# Altium schematic sheet FPGA-4.SchDoc
size A3; Date: Date; CompanyName: HESSO; Engineer: Name; Address1: Route du Rawyl 47; Address2: 1950 Sion; Address3: Switzerland; ProjectName: Project Name
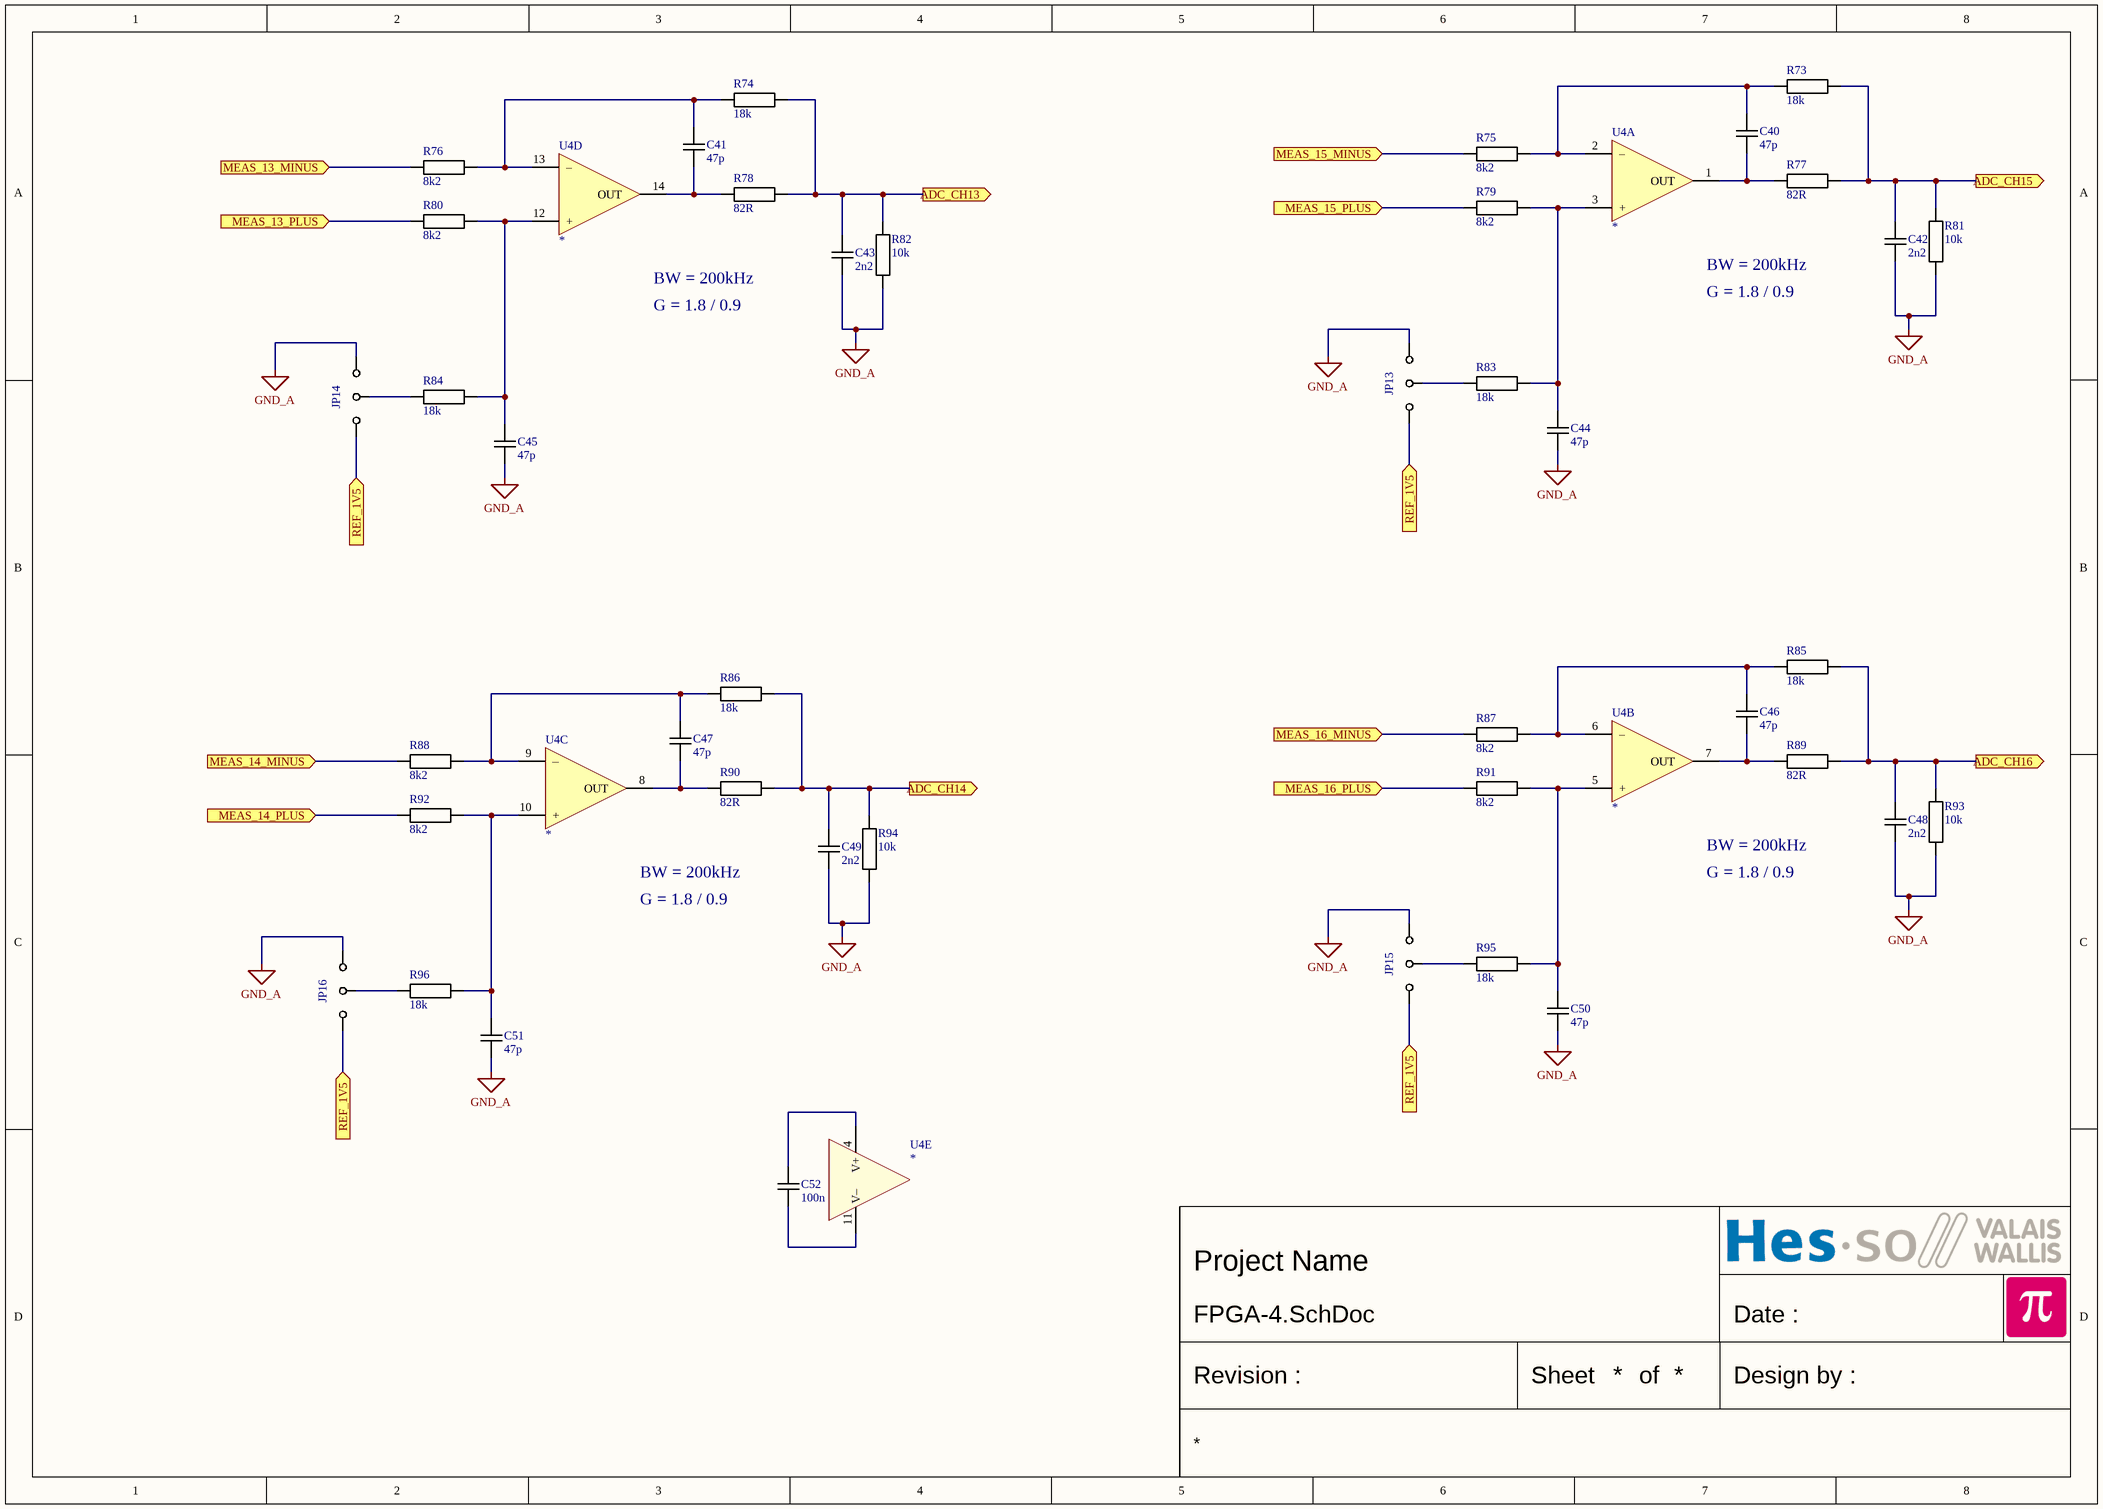
[diagram p0: FPGA-4.SchDoc]

## Parts
C40  47p  [CAPACITOR 1608 REFLOW]
C41  47p  [CAPACITOR 1608 REFLOW]
C42  2n2  [CAPACITOR 1608 REFLOW]
C43  2n2  [CAPACITOR 1608 REFLOW]
C44  47p  [CAPACITOR 1608 REFLOW]
C45  47p  [CAPACITOR 1608 REFLOW]
C46  47p  [CAPACITOR 1608 REFLOW]
C47  47p  [CAPACITOR 1608 REFLOW]
C48  2n2  [CAPACITOR 1608 REFLOW]
C49  2n2  [CAPACITOR 1608 REFLOW]
C50  47p  [CAPACITOR 1608 REFLOW]
C51  47p  [CAPACITOR 1608 REFLOW]
C52  100n  [CAPACITOR 1608 REFLOW]
JP13  {Value}  [JUMPER3 SMD 1608]  (value not drawn)
JP14  {Value}  [JUMPER3 SMD 1608]  (value not drawn)
JP15  {Value}  [JUMPER3 SMD 1608]  (value not drawn)
JP16  {Value}  [JUMPER3 SMD 1608]  (value not drawn)
R73  18k  [RESISTOR 1608 REFLOW]
R74  18k  [RESISTOR 1608 REFLOW]
R75  8k2  [RESISTOR 1608 REFLOW]
R76  8k2  [RESISTOR 1608 REFLOW]
R77  82R  [RESISTOR 1608 REFLOW]
R78  82R  [RESISTOR 1608 REFLOW]
R79  8k2  [RESISTOR 1608 REFLOW]
R80  8k2  [RESISTOR 1608 REFLOW]
R81  10k  [RESISTOR 1608 REFLOW]
R82  10k  [RESISTOR 1608 REFLOW]
R83  18k  [RESISTOR 1608 REFLOW]
R84  18k  [RESISTOR 1608 REFLOW]
R85  18k  [RESISTOR 1608 REFLOW]
R86  18k  [RESISTOR 1608 REFLOW]
R87  8k2  [RESISTOR 1608 REFLOW]
R88  8k2  [RESISTOR 1608 REFLOW]
R89  82R  [RESISTOR 1608 REFLOW]
R90  82R  [RESISTOR 1608 REFLOW]
R91  8k2  [RESISTOR 1608 REFLOW]
R92  8k2  [RESISTOR 1608 REFLOW]
R93  10k  [RESISTOR 1608 REFLOW]
R94  10k  [RESISTOR 1608 REFLOW]
R95  18k  [RESISTOR 1608 REFLOW]
R96  18k  [RESISTOR 1608 REFLOW]
U4  *  [SO14 P1.27 C4.0X8.8 H1.75]  (parts A,B,C,D,E of 5)

## Ports
ADC_CH13 (out), ADC_CH14 (out), ADC_CH15 (out), ADC_CH16 (out), MEAS_13_MINUS (in), MEAS_13_PLUS (in), MEAS_14_MINUS (in), MEAS_14_PLUS (in), MEAS_15_MINUS (in), MEAS_15_PLUS (in), MEAS_16_MINUS (in), MEAS_16_PLUS (in), REF_1V5 (in)

## Nets
GND_A: C42.1 C43.1 C44.1 C45.1 C48.1 C49.1 C50.1 C51.1 JP13.3 JP14.3 JP15.3 JP16.3 R81.2 R82.2 R93.2 R94.2
ADC_CH13: C43.2 R74.2 R78.2 R82.1 ; port ADC_CH13
ADC_CH14: C49.2 R86.2 R90.2 R94.1 ; port ADC_CH14
ADC_CH15: C42.2 R73.2 R77.2 R81.1 ; port ADC_CH15
ADC_CH16: C48.2 R85.2 R89.2 R93.1 ; port ADC_CH16
MEAS_13_MINUS: R76.1 ; port MEAS_13_MINUS
MEAS_13_PLUS: R80.1 ; port MEAS_13_PLUS
MEAS_14_MINUS: R88.1 ; port MEAS_14_MINUS
MEAS_14_PLUS: R92.1 ; port MEAS_14_PLUS
MEAS_15_MINUS: R75.1 ; port MEAS_15_MINUS
MEAS_15_PLUS: R79.1 ; port MEAS_15_PLUS
MEAS_16_MINUS: R87.1 ; port MEAS_16_MINUS
MEAS_16_PLUS: R91.1 ; port MEAS_16_PLUS
REF_1V5: JP13.1 JP14.1 JP15.1 JP16.1 ; port REF_1V5
NetC40_1: C40.1 R77.1 U4.1(OUT)
NetC40_2: C40.2 R73.1 R75.2 U4.2(–)
NetC41_1: C41.1 R78.1 U4.14(OUT)
NetC41_2: C41.2 R74.1 R76.2 U4.13(–)
NetC44_2: C44.2 R79.2 R83.1 U4.3(+)
NetC45_2: C45.2 R80.2 R84.1 U4.12(+)
NetC46_1: C46.1 R89.1 U4.7(OUT)
NetC46_2: C46.2 R85.1 R87.2 U4.6(–)
NetC47_1: C47.1 R90.1 U4.8(OUT)
NetC47_2: C47.2 R86.1 R88.2 U4.9(–)
NetC50_2: C50.2 R91.2 R95.1 U4.5(+)
NetC51_2: C51.2 R92.2 R96.1 U4.10(+)
NetC52_1: C52.1 U4.11(V–)
NetC52_2: C52.2 U4.4(V+)
NetJP13_2: JP13.2 R83.2
NetJP14_2: JP14.2 R84.2
NetJP15_2: JP15.2 R95.2
NetJP16_2: JP16.2 R96.2

## Notes on the sheet
- BW = 200kHz
- G = 1.8 / 0.9
- Date :
- Revision :
- Sheet
- of
- Design by :

## Library data of the parts
C40-C52 = Capacitor: Capacitor X7R 10% 50V 1608(0603)
  C40 C41 C44-C47 C50 C51: Value: 47p
  C42 C43 C48 C49: Value: 2n2
  C52: Value: 100n
JP13-JP16 = JUMPER 3 POS: Value: {Value}
R73-R96 = Resistor: Resistor 1% 50V 100mW 1608(0603)
  R73 R74 R83-R86 R95 R96: Value: 18k
  R75 R76 R79 R80 R87 R88 R91 R92: Value: 8k2
  R77 R78 R89 R90: Value: 82R
  R81 R82 R93 R94: Value: 10k
U4 = OPA QUAD: Generic quad OPA 14 pins; Value: *